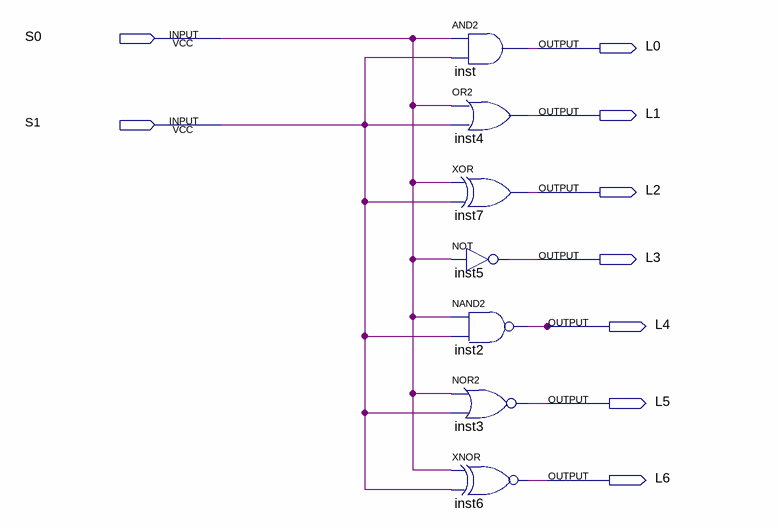
[diagram p0: schematic sheet]
// Quartus schematic exercise1.bdf as structural Verilog: 7 symbols, 9 pins
module exercise1 (
  input  S0,
  input  S1,
  output L0,
  output L1,
  output L2,
  output L3,
  output L4,
  output L5,
  output L6
);

  and inst (L0, S0, S1);
  or inst4 (L1, S0, S1);
  xor inst7 (L2, S0, S1);
  not inst5 (L3, S0);
  nand inst2 (L4, S0, S1);
  nor inst3 (L5, S0, S1);
  xnor inst6 (L6, S0, S1);
endmodule
